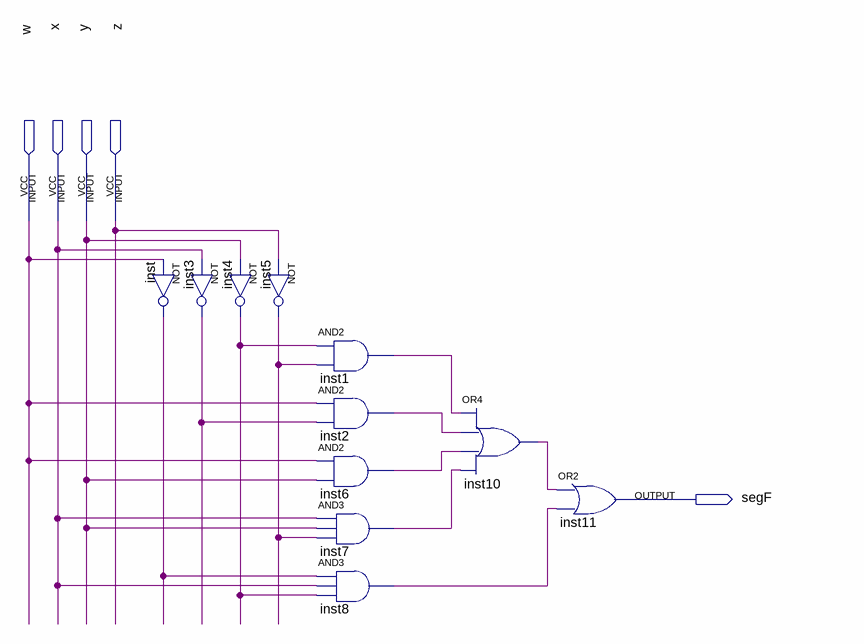
[diagram p0: schematic sheet]
// Quartus schematic segF.bdf as structural Verilog: 11 symbols, 5 pins
module segF (
  input  w,
  input  x,
  input  y,
  input  z,
  output segF
);

  wire inst1_out, inst2_out, inst3_out, inst4_out, inst5_out, inst6_out, inst7_out, inst8_out, inst10_out,
       inst_out;

  not inst (inst_out, w);
  not inst3 (inst3_out, x);
  not inst4 (inst4_out, y);
  not inst5 (inst5_out, z);
  and inst1 (inst1_out, inst4_out, inst5_out);
  and inst2 (inst2_out, w, inst3_out);
  and inst6 (inst6_out, w, y);
  and inst7 (inst7_out, x, y, inst5_out);
  and inst8 (inst8_out, inst_out, x, inst4_out);
  or inst10 (inst10_out, inst1_out, inst2_out, inst6_out, inst7_out);
  or inst11 (segF, inst10_out, inst8_out);
endmodule
